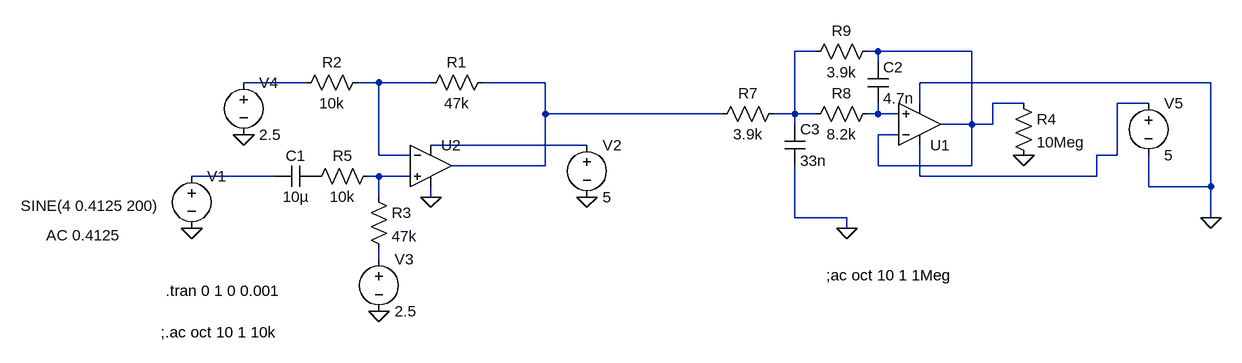
[diagram p0: schematic analogue_circuit.asc]
analogue_circuit.asc, the LTspice schematic file:
Version 4
SHEET 1 1620 680
WIRE 992 -240 960 -240
WIRE 1088 -240 1072 -240
WIRE 1232 -240 1088 -240
WIRE 1088 -224 1088 -240
WIRE 208 -192 112 -192
WIRE 320 -192 288 -192
WIRE 400 -192 320 -192
WIRE 576 -192 480 -192
WIRE 1600 -192 1152 -192
WIRE 1152 -160 1152 -192
WIRE 1312 -160 1264 -160
WIRE 1504 -160 1456 -160
WIRE 576 -144 576 -192
WIRE 848 -144 576 -144
WIRE 960 -144 960 -240
WIRE 960 -144 928 -144
WIRE 992 -144 960 -144
WIRE 1088 -144 1088 -160
WIRE 1088 -144 1072 -144
WIRE 1120 -144 1088 -144
WIRE 960 -128 960 -144
WIRE 1232 -128 1232 -240
WIRE 1232 -128 1184 -128
WIRE 1264 -128 1264 -160
WIRE 1264 -128 1232 -128
WIRE 1120 -112 1088 -112
WIRE 640 -96 400 -96
WIRE 320 -80 320 -192
WIRE 368 -80 320 -80
WIRE 1456 -80 1456 -160
WIRE 1456 -80 1424 -80
WIRE 576 -64 576 -144
WIRE 576 -64 432 -64
WIRE 1088 -64 1088 -112
WIRE 1232 -64 1232 -128
WIRE 1232 -64 1088 -64
WIRE 160 -48 32 -48
WIRE 320 -48 304 -48
WIRE 368 -48 320 -48
WIRE 1152 -48 1152 -96
WIRE 1424 -48 1424 -80
WIRE 1424 -48 1152 -48
WIRE 1504 -32 1504 -80
WIRE 1600 -32 1600 -192
WIRE 1600 -32 1504 -32
WIRE 320 -16 320 -48
WIRE 400 -16 400 -32
WIRE 960 16 960 -64
WIRE 1040 16 960 16
WIRE 1600 16 1600 -32
WIRE 1040 32 1040 16
WIRE 320 80 320 64
FLAG 32 32 0
FLAG 640 -16 0
FLAG 400 -16 0
FLAG 320 160 0
FLAG 112 -112 0
FLAG 1040 32 0
FLAG 1312 -80 0
FLAG 1600 16 0
SYMBOL cap 224 -64 R90
WINDOW 0 0 32 VBottom 2
WINDOW 3 32 32 VTop 2
SYMATTR InstName C1
SYMATTR Value 10µ
SYMBOL voltage 32 -64 R0
WINDOW 3 -263 61 Left 2
WINDOW 123 -224 107 Left 2
WINDOW 39 0 0 Left 2
SYMATTR Value SINE(4 0.4125 200)
SYMATTR Value2 AC 0.4125
SYMATTR InstName V1
SYMBOL voltage 640 -112 R0
WINDOW 123 0 0 Left 2
WINDOW 39 0 0 Left 2
SYMATTR InstName V2
SYMATTR Value 5
SYMBOL res 496 -208 R90
WINDOW 0 0 56 VBottom 2
WINDOW 3 32 56 VTop 2
SYMATTR InstName R1
SYMATTR Value 47k
SYMBOL res 304 -208 R90
WINDOW 0 0 56 VBottom 2
WINDOW 3 32 56 VTop 2
SYMATTR InstName R2
SYMATTR Value 10k
SYMBOL voltage 320 64 R0
WINDOW 123 0 0 Left 2
WINDOW 39 0 0 Left 2
SYMATTR InstName V3
SYMATTR Value 2.5
SYMBOL res 304 -32 R0
SYMATTR InstName R3
SYMATTR Value 47k
SYMBOL res 320 -64 R90
WINDOW 0 0 56 VBottom 2
WINDOW 3 32 56 VTop 2
SYMATTR InstName R5
SYMATTR Value 10k
SYMBOL voltage 112 -208 R0
WINDOW 123 0 0 Left 2
WINDOW 39 0 0 Left 2
SYMATTR InstName V4
SYMATTR Value 2.5
SYMBOL res 944 -160 R90
WINDOW 0 0 56 VBottom 2
WINDOW 3 32 56 VTop 2
SYMATTR InstName R7
SYMATTR Value 3.9k
SYMBOL res 1088 -160 R90
WINDOW 0 0 56 VBottom 2
WINDOW 3 32 56 VTop 2
SYMATTR InstName R8
SYMATTR Value 8.2k
SYMBOL res 1088 -256 R90
WINDOW 0 0 56 VBottom 2
WINDOW 3 32 56 VTop 2
SYMATTR InstName R9
SYMATTR Value 3.9k
SYMBOL cap 1072 -224 R0
SYMATTR InstName C2
SYMATTR Value 4.7n
SYMBOL cap 944 -128 R0
SYMATTR InstName C3
SYMATTR Value 33n
SYMBOL res 1296 -176 R0
SYMATTR InstName R4
SYMATTR Value 10Meg
SYMBOL voltage 1504 -176 R0
WINDOW 123 0 0 Left 2
WINDOW 39 0 0 Left 2
SYMATTR InstName V5
SYMATTR Value 5
SYMBOL Opamps\\UniversalOpamp2 1152 -128 M180
SYMATTR InstName U1
SYMBOL Opamps\\UniversalOpamp2 400 -64 R0
SYMATTR InstName U2
TEXT -16 192 Left 2 !;.ac oct 10 1 10k
TEXT -8 128 Left 2 !.tran 0 1 0 0.001
TEXT 1008 104 Left 2 !;ac oct 10 1 1Meg

The netlist it stands for:
* analogue_circuit.asc
C1 P001 N009 10µ
V1 N009 0 SINE(4 0.4125 200) AC 0.4125
V2 N008 0 5
R1 N005 N004 47k
R2 N004 N003 10k
V3 N011 0 2.5
R3 N010 N011 47k
R5 N010 P001 10k
V4 N003 0 2.5
R7 N001 N005 3.9k
R8 N007 N001 8.2k
R9 N002 N001 3.9k
C2 N002 N007 4.7n
C3 N001 0 33n
R4 N002 0 10Meg
V5 N006 0 5
XU1 N007 N002 N006 0 N002 level.2 Avol=1Meg GBW=10Meg Slew=10Meg ilimit=25m rail=0 Vos=0 phimargin=45 en=0 enk=0 in=0 ink=0 Rin=500Meg  ; pins IN+ IN- V+ V- OUT
XU2 N010 N004 N008 0 N005 level.2 Avol=1Meg GBW=10Meg Slew=10Meg ilimit=25m rail=0 Vos=0 phimargin=45 en=0 enk=0 in=0 ink=0 Rin=500Meg  ; pins IN+ IN- V+ V- OUT
;.ac oct 10 1 10k
.tran 0 1 0 0.001
;ac oct 10 1 1Meg
.lib UniversalOpamps2.sub
.backanno
.end